# EAGLE schematic gripper (EAGLE 6.2)
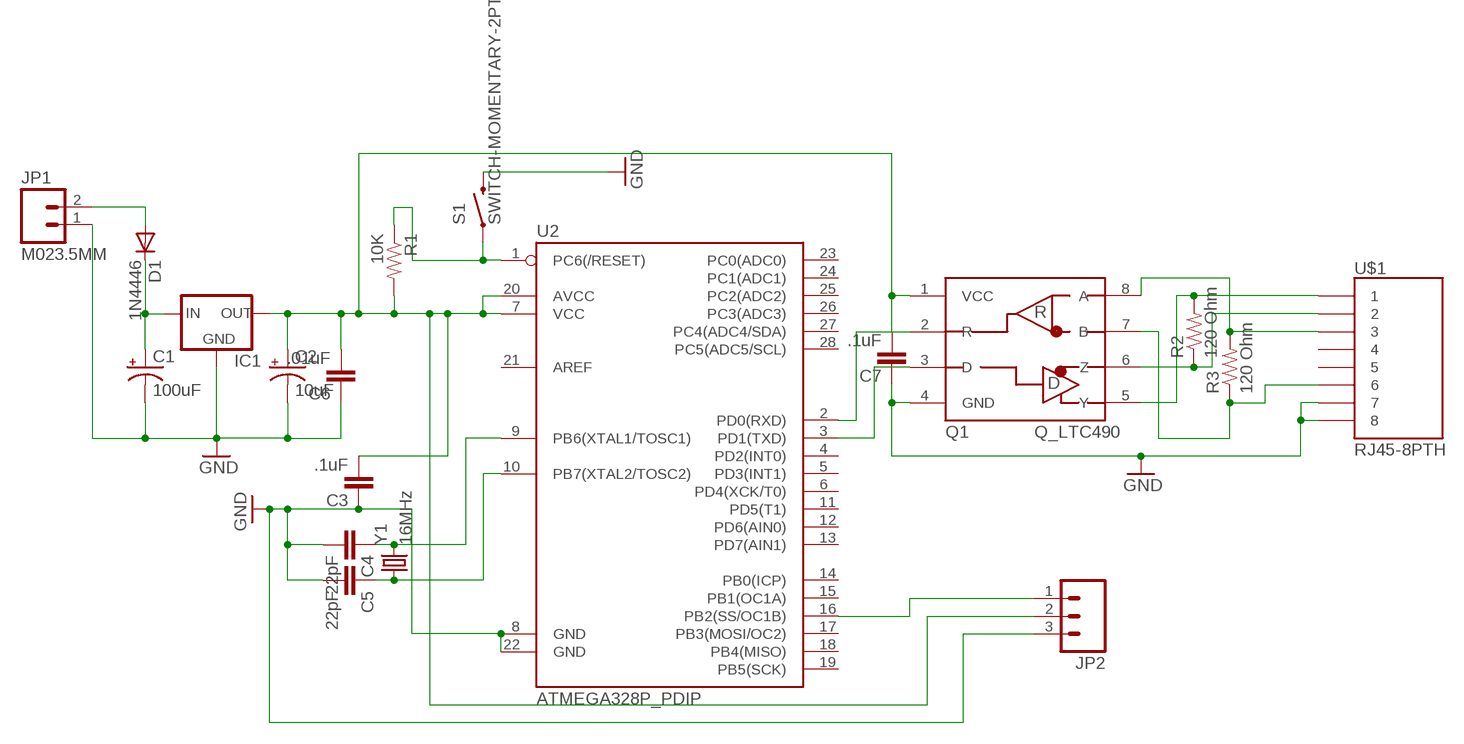
[diagram p0: schematic, sheet 1]

## Parts
C1  100uF  CAP_POLPTH1  [CPOL-RADIAL-100UF-25V]
C2  10uF  CAP_POLPTH2  [CPOL-RADIAL-10UF-25V]
C3  .1uF  CAPKIT  [CAP-PTH-SMALL-KIT]
C4  22pF  CAPKIT  [CAP-PTH-SMALL-KIT]
C5  22pF  CAPKIT  [CAP-PTH-SMALL-KIT]
C6  .01uF  CAPKIT  [CAP-PTH-SMALL-KIT]
C7  .1uF  CAPKIT  [CAP-PTH-SMALL-KIT]
D1  1N4446  [DO35-10]
IC1  V_REG_78XXTO-92  [TO-92]
JP1  M023.5MM  [SCREWTERMINAL-3.5MM-2]
JP2  M03POLAR  [MOLEX-1X3]
Q1  Q_LTC490  [DIP8]
R1  10K  RESISTORKIT  [AXIAL-0.3-KIT]
R2  120 Ohm  RESISTORKIT  [AXIAL-0.3-KIT]
R3  120 Ohm  RESISTORKIT  [AXIAL-0.3-KIT]
S1  SWITCH-MOMENTARY-2PTH  [TACTILE-PTH]
U2  ATMEGA328P_PDIP  [DIL28-3]
U$1  RJ45-8PTH  [RJ45-8]
Y1  16MHz  CRYSTALHC49US  [HC49US]

## Nets
GND: C1.2(-) C2.2(-) C3.1 C4.2 C5.2 C6.1 C7.1 IC1.1(GND) JP1.1 JP2.3 Q1.4(GND) S1.3 U2.8(GND) U2.22(GND) U$1.7 U$1.8
N$1: D1.A JP1.2
N$2: C1.1(+) D1.C IC1.2(IN)
N$3: C2.1(+) C3.2 C6.2 C7.2 IC1.3(OUT) JP2.2 Q1.1(VCC) R1.P$2 U2.7(VCC) U2.20(AVCC)
N$4: R1.P$1 S1.1 U2.1(PC6(/RESET))
N$5: Q1.5(Y) R2.P$2 U$1.1
N$6: C4.1 U2.9(PB6(XTAL1/TOSC1)) Y1.2
N$7: C5.1 U2.10(PB7(XTAL2/TOSC2)) Y1.1
N$8: JP2.1 U2.16(PB2(SS/OC1B))
N$9: Q1.2(R) U2.2(PD0(RXD))
N$10: Q1.3(D) U2.3(PD1(TXD))
N$11: Q1.8(A) R3.P$2 U$1.3
N$12: Q1.6(Z) R2.P$1 U$1.2
N$13: Q1.7(B) R3.P$1 U$1.6
Unconnected: U2.4(PD2(INT0)) U2.5(PD3(INT1)) U2.6(PD4(XCK/T0)) U2.11(PD5(T1)) U2.12(PD6(AIN0)) U2.13(PD7(AIN1)) U2.14(PB0(ICP)) U2.15(PB1(OC1A)) U2.17(PB3(MOSI/OC2)) U2.18(PB4(MISO)) U2.19(PB5(SCK)) U2.21(AREF) U2.23(PC0(ADC0)) U2.24(PC1(ADC1)) U2.25(PC2(ADC2)) U2.26(PC3(ADC3)) U2.27(PC4(ADC4/SDA)) U2.28(PC5(ADC5/SCL)) U$1.4 U$1.5

## Library data of the parts
C1 C2 = SparkFun-Passives:CAP_POL: Capacitor Polarized These are standard SMD and PTH capacitors. Normally 10uF, 47uF, and 100uF in electrolytic and tantalum varieties. Always verify the external diameter of the through hole cap, it varies with capacity, voltage, and manufacturer. The EIA devices should be standard.
C3-C7 = SparkFun-Capacitors:CAP: Capacitor Standard 0603 ceramic capacitor, and 0.1" leaded capacitor.
D1 = diode:1N4446: DIODE high speed (Philips)
IC1 = SparkFun-PowerIC:V_REG_78XX: Voltage Regulator Standard 7805 5V regulator. IGO (Input Ground Output). Spark Fun Electronics SKU : COM-00107
JP1 = SparkFun-Connectors:M02: Standard 2-pin 0.1" header. Use with - straight break away headers ( PRT-00116) - right angle break away headers (PRT-00553) - swiss pins (PRT-00743) - machine pins (PRT-00117) - female headers (PRT-00115) Molex polarized connector foot print use with: PRT-08233 with associated crimp pins and housings. 2.54_SCREWTERM for use with PRT-10571. 3.5mm Screw Terminal footprints for PRT-08084 5mm Screw Terminal footprints for use with PRT-08433
JP2 = SparkFun-Connectors:M03: Header 3 Standard 3-pin 0.1" header. Use with straight break away headers (SKU : PRT-00116), right angle break away headers (PRT-00553), swiss pins (PRT-00743), machine pins (PRT-00117), and female headers (PRT-00115). Molex polarized connector foot print use with SKU : PRT-08232 with associated crimp pins and housings.
Q1 = PCB0M1:Q_LTC490: IC, RS422-RS485 DRVR
R1-R3 = SparkFun-Passives:RESISTOR: Resistor Basic schematic elements and footprints for 0603, 1206, and PTH resistors.
S1 = SparkFun-Electromechanical:SWITCH-MOMENTARY-2: Various NO switches- pushbuttons, reed, etc
U2 = SparkFun-DigitalIC:ATMEGA328P_PDIP: uC used in the Arduino 32kb flash, 1k EEPROM, 2k SRAM This is the through-hole version of this chip.
U$1 = SparkFun-Connectors:RJ45-8: RJ45 Jack Simple RJ45, 8-pin connection - connector for common Cat5, Cat5e, and Cat6 Ethernet cables. Footprint not yet proven in production. Connector sku is PRT-00643; Breakout PCB sku is BOB-00716.
Y1 = SparkFun-FreqCtrl:CRYSTAL: Various standard crystals. Proven footprints. Spark Fun Electronics SKU : COM-00534